# Altium schematic sheet STM32.SchDoc
size A
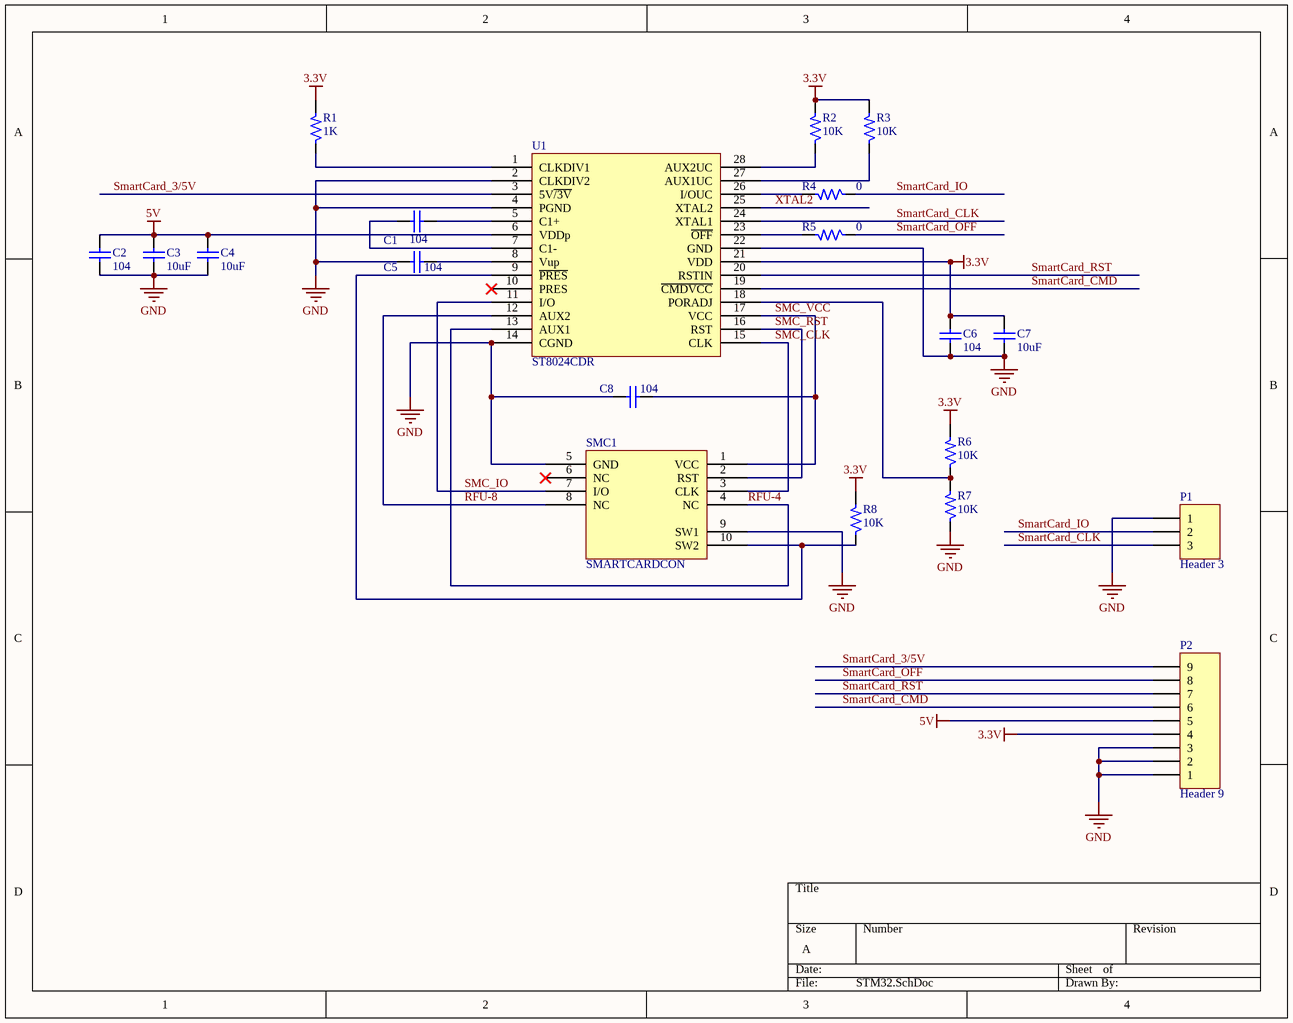
[diagram p0: STM32.SchDoc]

## Parts
C1  104  [TU_SMD_0805]
C2  104  [TU_SMD_0805]
C3  10uF  [TU_SMD_0805]
C4  10uF  [TU_SMD_0805]
C5  104  [TU_SMD_0805]
C6  104  [TU_SMD_0805]
C7  10uF  [TU_SMD_0805]
C8  104  [TU_SMD_0805]
P1  Header 3  [HDR1X3]
P2  Header 9  [HDR1X9]
R1  1K  [Tro SMD 0805]
R2  10K  [Tro SMD 0805]
R3  10K  [Tro SMD 0805]
R4  0  [Tro SMD 0805]
R5  0  [Tro SMD 0805]
R6  10K  [Tro SMD 0805]
R7  10K  [Tro SMD 0805]
R8  10K  [Tro SMD 0805]
SMC1  SMARTCARDCON  [Smartcart_CON]
U1  ST8024CDR  [SOIC-SO28_N]

## Nets
3.3V: C6.1 C7.1 P2.4 R1.2 R2.2 R3.2 R6.2 R8.2 U1.21(VDD)
5V: C2.1 C3.1 C4.1 P2.5 U1.6(VDDp)
GND: C2.2 C3.2 C4.2 C5.2 C6.2 C7.2 C8.2 P1.1 P2.1 P2.2 P2.3 R7.1 SMC1.5(GND) SMC1.9(SW1) U1.2(CLKDIV2) U1.4(PGND) U1.14(CGND) U1.22(GND)
RFU-4: SMC1.4(NC) U1.13(AUX1)
RFU-8: SMC1.8(NC) U1.12(AUX2)
SmartCard_3/5V: P2.9 U1.3(5V~{/3V})
SmartCard_CLK: P1.3 U1.24(XTAL1)
SmartCard_CMD: P2.6 U1.19(~{CMDVCC})
SmartCard_IO: P1.2 R4.1
SmartCard_OFF: P2.8 R5.1
SmartCard_RST: P2.7 U1.20(RSTIN)
SMC_CLK: SMC1.3(CLK) U1.15(CLK)
SMC_IO: SMC1.7(I/O) U1.11(I/O)
SMC_RST: SMC1.2(RST) U1.16(RST)
SMC_VCC: C8.1 SMC1.1(VCC) U1.17(VCC)
XTAL2: U1.25(XTAL2)
NetC1_1: C1.1 U1.5(C1+)
NetC1_2: C1.2 U1.7(C1-)
NetC5_1: C5.1 U1.8(Vup)
NetR1_1: R1.1 U1.1(CLKDIV1)
NetR2_1: R2.1 U1.28(AUX2UC)
NetR3_1: R3.1 U1.27(AUX1UC)
NetR4_2: R4.2 U1.26(I/OUC)
NetR5_2: R5.2 U1.23(~{OFF})
NetR6_1: R6.1 R7.2 U1.18(PORADJ)
NetR8_1: R8.1 SMC1.10(SW2) U1.9(~{PRES})

Not connected (* = marked no-connect by the designer): SMC1 6(NC)*; U1 10(PRES)*

## Library data of the parts
C1-C8 = Capacitor 0805: Ceramic Chip Capacitor - Standard; Note: Footprint corresponds to dimensions for bulk cassette packaging. This case size has tightened tolerances.; Published: 17-Jul-2002; LatestRevisionDate: 19-Mar-2004; LatestRevisionNote: Silkscreen size reduced.; DatasheetDocument: Mar-2001; PackageDocument: Mar-2001; PackageReference: 0805; Publisher: Altium Limited; Code_JEITA: 0805; Code_IPC: 2012[0805]; ComponentLink1Description: Manufacturer Link; ComponentLink1URL: http://www.kemet.com/; ComponentLink2Description: Datasheet; ComponentLink2URL: http://www.kemet.com/kemet/web/homepage/kechome.nsf/vapubfilesname/F3102TA.pdf/$file/F3102TA.pdf
  C1 C2 C5 C6 C8: Value: 104
  C3 C4 C7: Value: 10uF
P1 = Header 3: Header, 3-Pin; LatestRevisionDate: 17-Jul-2002; LatestRevisionNote: Re-released for DXP Platform.; Publisher: Altium Limited
P2 = Header 9: Header, 9-Pin; LatestRevisionDate: 17-Jul-2002; LatestRevisionNote: Re-released for DXP Platform.; Publisher: Altium Limited
R1-R8 = R: Resistor 1/4W
  R1: Value: 1K
  R2 R3 R6-R8: Value: 10K
  R4 R5: Value: 0
U1 = ST8024